# EAGLE schematic wheel_board_front (EAGLE 9.5.0)
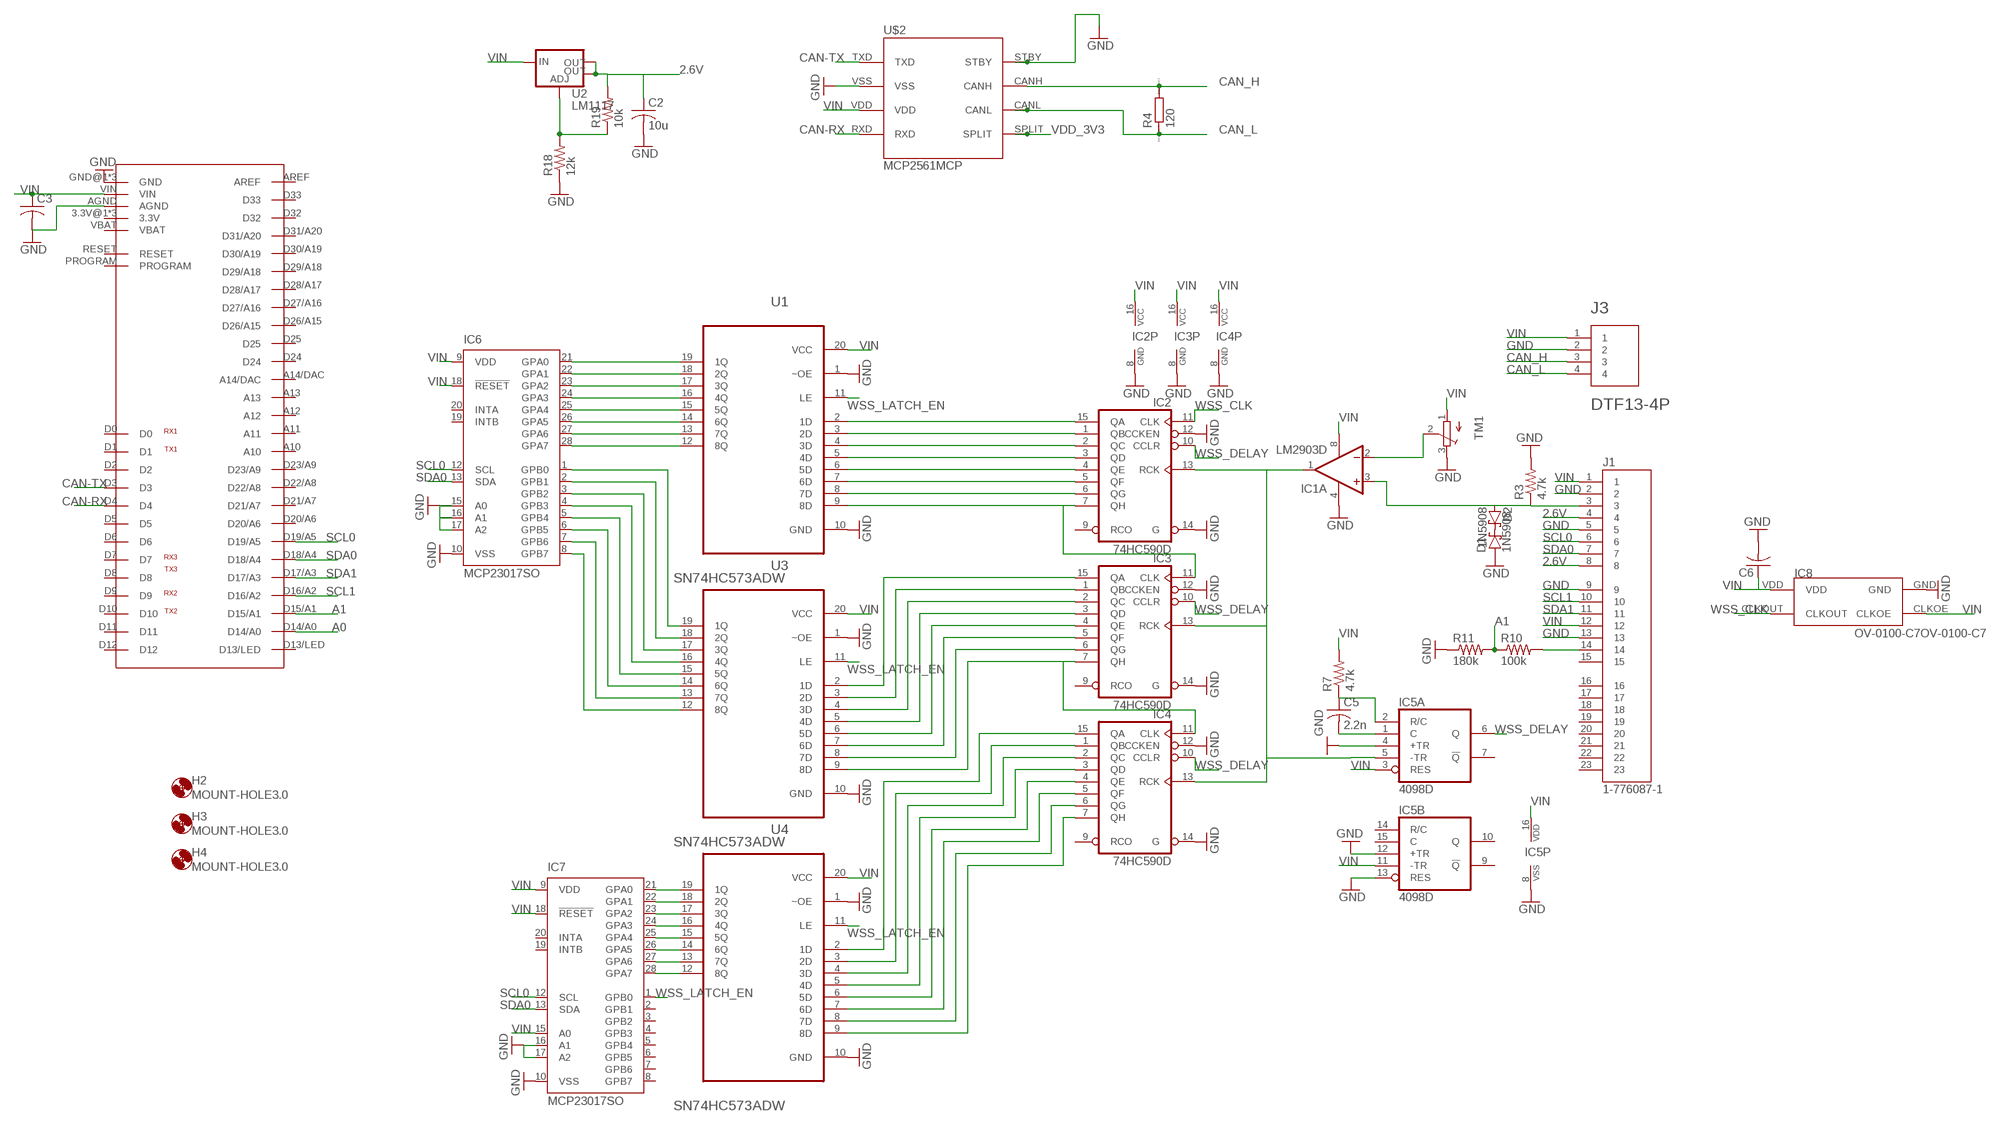
[diagram p0: schematic, sheet 1]

## Parts
C2  10u  C-US050-024X044  [C050-024X044]
C3  C-US050-024X044  [C050-024X044]
C5  2.2n  C-US025-024X044  [C025-024X044]
C6  C-US050-024X044  [C050-024X044]
D1  1N5908  [C4111-15]
D2  1N5908  [C4111-15]
H2  MOUNT-HOLE3.0  [3,0]
H3  MOUNT-HOLE3.0  [3,0]
H4  MOUNT-HOLE3.0  [3,0]
IC1  LM2903D  [SO08]
IC2  74HC590D  [SO16]
IC3  74HC590D  [SO16]
IC4  74HC590D  [SO16]
IC5  4098D  [SO16]
IC6  MCP23017SO  [SO28W]
IC7  MCP23017SO  [SO28W]
IC8  OV-0100-C7OV-0100-C7  [DFN320X150X100-4N]
J1  1-776087-1  [TE_1-776087-1]
J3  DTF13-4P  [TE_DTF13-4P]
R3  4.7k  R-US_0204/7  [0204/7]
R4  120  R  [R0805]
R7  4.7k  R-US_0204/7  [0204/7]
R10  100k  R-US_0204/7  [0204/7]
R11  180k  R-US_0204/7  [0204/7]
R18  12k  R-US_0204/7  [0204/7]
R19  10k  R-US_0204/7  [0204/7]
TM1  TRIMPOTTC33X  [TC33X]
U1  SN74HC573ADW  [SOIC127P1030X265-20N]
U2  LM1117  V_REG_LM1117SOT223  [SOT223]
U3  SN74HC573ADW  [SOIC127P1030X265-20N]
U4  SN74HC573ADW  [SOIC127P1030X265-20N]
U$2  MCP2561MCP  [MCP2561_PDIP]
U$3  TEENSY3.1_ALL  [TEENSY3.1_ALL]

## Nets
2.6V [pwr]: C2.1 J1.4 J1.8 R19.2 U2.2(OUT) U2.4(OUT)
A0: U$3.D14/A0
A1: R10.1 R11.2 U$3.D15/A1
CAN-RX: U$2.RXD U$3.D4
CAN-TX: U$2.TXD U$3.D3
CAN_H: J3.3 R4.2 U$2.CANH
CAN_L: J3.4 R4.1 U$2.CANL
GND [pwr]: C2.2 C3.2 C6.2 D1.A IC1.4(P:V-) IC2.8(GND) IC2.12(CCKEN) IC2.14(G) IC3.8(GND) IC3.12(CCKEN) IC3.14(G) IC4.8(GND) IC4.12(CCKEN) IC4.14(G) IC5.4(A:+TR) IC5.8(P:VSS) IC5.12(B:+TR) IC5.13(B:RES) IC6.10(VSS) IC6.15(A0) IC6.16(A1) IC6.17(A2) IC7.10(VSS) IC7.16(A1) IC7.17(A2) IC8.GND J1.2 J1.5 J1.9 J1.13 J3.2 R3.2 R11.1 R18.1 TM1.3(E) U1.1(~OE) U1.10(GND) U3.1(~OE) U3.10(GND) U4.1(~OE) U4.10(GND) U$2.STBY U$2.VSS U$3.AGND U$3.GND@1(GND) U$3.GND@2(GND) U$3.GND@3(GND)
N$1 [pwr]: D2.A IC1.3(A:+IN) J1.3 R3.1
N$2: J1.14 R10.2
N$3: IC1.2(A:-IN) TM1.2(S)
N$4: C5.1 IC5.2(A:R/C) R7.1
N$5: IC2.15(QA) U1.2(1D)
N$8: C5.2 IC5.1(A:C)
N$9: IC1.1(A:OUT) IC2.13(RCK) IC3.13(RCK) IC4.13(RCK) IC5.5(A:-TR)
N$10: IC2.7(QH) IC3.11(CLK) U1.9(8D)
N$11: IC3.7(QH) IC4.11(CLK) U3.9(8D)
N$12: IC2.1(QB) U1.3(2D)
N$13 [pwr]: D1.C D2.C
N$14 [pwr]: R18.2 R19.1 U2.1(ADJ)
N$15: IC2.2(QC) U1.4(3D)
N$16: IC2.3(QD) U1.5(4D)
N$17: IC2.4(QE) U1.6(5D)
N$18: IC2.5(QF) U1.7(6D)
N$19: IC2.6(QG) U1.8(7D)
N$20: IC3.15(QA) U3.2(1D)
N$21: IC3.1(QB) U3.3(2D)
N$22: IC3.2(QC) U3.4(3D)
N$23: IC3.3(QD) U3.5(4D)
N$24: IC3.4(QE) U3.6(5D)
N$25: IC3.5(QF) U3.7(6D)
N$26: IC3.6(QG) U3.8(7D)
N$27: IC4.15(QA) U4.2(1D)
N$28: IC4.1(QB) U4.3(2D)
N$29: IC4.2(QC) U4.4(3D)
N$30: IC4.3(QD) U4.5(4D)
N$31: IC4.4(QE) U4.6(5D)
N$32: IC4.5(QF) U4.7(6D)
N$33: IC4.6(QG) U4.8(7D)
N$34: IC4.7(QH) U4.9(8D)
N$35: IC6.21(GPA0) U1.19(1Q)
N$36: IC6.22(GPA1) U1.18(2Q)
N$37: IC6.23(GPA2) U1.17(3Q)
N$38: IC6.24(GPA3) U1.16(4Q)
N$39: IC6.25(GPA4) U1.15(5Q)
N$40: IC6.26(GPA5) U1.14(6Q)
N$41: IC6.27(GPA6) U1.13(7Q)
N$42: IC6.28(GPA7) U1.12(8Q)
N$43: IC6.1(GPB0) U3.19(1Q)
N$44: IC6.2(GPB1) U3.18(2Q)
N$45: IC6.3(GPB2) U3.17(3Q)
N$46: IC6.4(GPB3) U3.16(4Q)
N$47: IC6.5(GPB4) U3.15(5Q)
N$48: IC6.6(GPB5) U3.14(6Q)
N$49: IC6.7(GPB6) U3.13(7Q)
N$50: IC6.8(GPB7) U3.12(8Q)
N$51: IC7.21(GPA0) U4.19(1Q)
N$52: IC7.22(GPA1) U4.18(2Q)
N$53: IC7.23(GPA2) U4.17(3Q)
N$54: IC7.24(GPA3) U4.16(4Q)
N$55: IC7.25(GPA4) U4.15(5Q)
N$56: IC7.26(GPA5) U4.14(6Q)
N$57: IC7.27(GPA6) U4.13(7Q)
N$58: IC7.28(GPA7) U4.12(8Q)
SCL0: IC6.12(SCL) IC7.12(SCL) J1.6 U$3.D19/A5
SCL1: J1.10 U$3.D16/A2
SDA0: IC6.13(SDA) IC7.13(SDA) J1.7 U$3.D18/A4
SDA1: J1.11 U$3.D17/A3
VDD_3V3: U$2.SPLIT
VIN [pwr]: C3.1 C6.1 IC1.8(P:V+) IC2.16(VCC) IC3.16(VCC) IC4.16(VCC) IC5.3(A:RES) IC5.11(B:-TR) IC5.16(P:VDD) IC6.9(VDD) IC6.18(!RESET) IC7.9(VDD) IC7.15(A0) IC7.18(!RESET) IC8.CLKOE IC8.VDD J1.1 J1.12 J3.1 R7.2 TM1.1(A) U1.20(VCC) U2.3(IN) U3.20(VCC) U4.20(VCC) U$2.VDD U$3.VIN
WSS_CLK: IC2.11(CLK) IC8.CLKOUT
WSS_DELAY: IC2.10(CCLR) IC3.10(CCLR) IC4.10(CCLR) IC5.6(A:Q)
WSS_LATCH_EN: IC7.1(GPB0) U1.11(LE) U3.11(LE) U4.11(LE)
Unconnected: IC1.5(B:+IN) IC1.6(B:-IN) IC1.7(B:OUT) IC2.9(RCO) IC3.9(RCO) IC4.9(RCO) IC5.7(A:!Q) IC5.9(B:!Q) IC5.10(B:Q) IC5.14(B:R/C) IC5.15(B:C) IC6.19(INTB) IC6.20(INTA) IC7.2(GPB1) IC7.3(GPB2) IC7.4(GPB3) IC7.5(GPB4) IC7.6(GPB5) IC7.7(GPB6) IC7.8(GPB7) IC7.19(INTB) IC7.20(INTA) J1.15 J1.16 J1.17 J1.18 J1.19 J1.20 J1.21 J1.22 J1.23 U$3.3.3V@1(3.3V) U$3.3.3V@2(3.3V) U$3.3.3V@3(3.3V) U$3.A10 U$3.A11 U$3.A12 U$3.A13 U$3.A14/DAC U$3.AREF U$3.D0 U$3.D1 U$3.D2 U$3.D5 U$3.D6 U$3.D7 U$3.D8 U$3.D9 U$3.D10 U$3.D11 U$3.D12 U$3.D13/LED U$3.D20/A6 U$3.D21/A7 U$3.D22/A8 U$3.D23/A9 U$3.D24 U$3.D25 U$3.D26/A15 U$3.D27/A16 U$3.D28/A17 U$3.D29/A18 U$3.D30/A19 U$3.D31/A20 U$3.D32 U$3.D33 U$3.PROGRAM U$3.RESET U$3.VBAT

## Library data of the parts
C2 C3 C5 C6 = rcl:C-US: CAPACITOR, American symbol; SPICEPREFIX: C
D1 D2 = diode:1N5908: DIODE schottky
H2-H4 = holes:MOUNT-HOLE: MOUNTING HOLE with drill center marker
IC1 = linear:LM2903: COMPARATOR
IC2-IC4 = 74xx-eu:74*590: 8-bit binary COUNTER, output register
IC5 = 40xx:4098: Dual monostable MULTIVIBRATOR Source: Texas Instruments (Data sheet acquired frm Harris Semiconductor SCHS065) http://pdf1.alldatasheet.com/datasheet-pdf/view/26897/TI/CD4098.html
IC6 IC7 = adafruit:MCP23017: http://ww1.microchip.com/downloads/en/DeviceDoc/21952a.pdf Source: http://ww1.microchip.com/downloads/en/DeviceDoc/21952a.pdf
IC8 = OV-0100-C7:OV-0100-C7
J1 = 1-776087-1:1-776087-1: 23 Positions Header Connector 0.157" (4.00mm) Panel Mount, Through Hole, Right Angle Gold-Palladium, Black; AVAILABILITY: Unavailable; COMMENT: 1-776087-1; DESCRIPTION: AMPSEAL Series; 4mm Pitch 23 Way 3 Row Right Angle PCB Header; Solder Term; 8A; EU_ROHS_COMPLIANCE: Compliant; MF: TE Connectivity; MP: 1-776087-1; PACKAGE: None; PRICE: None; TE_PURCHASE_URL: https://www.te.com/usa-en/product-1-776087-1.html?te_bu=Cor&te_type=disp&te_campaign=seda_glo_cor-seda-global-disp-prtnr-fy19-seda-model-bom-cta_sma-317_1&elqCampaignId=32493
J3 = DTF13-4P:DTF13-4P: none; AVAILABILITY: In stock; MF: TE Connectivity; MPN: DTF13-4P; PARTREV: NC; STANDARD: Manufacturer recommendation
R3 R7 R10 R11 R18 R19 = rcl:R-US_: RESISTOR, American symbol; SPICEPREFIX: R
R4 = eagle-ltspice:R: RESISTOR, European symbol; SPICEMODEL: NONE; SPICEPREFIX: R
TM1 = adafruit:TRIMPOT: SMT trimmer potentiometer part number TC33X http://www.ladyada.net/library/eagle
U1 U3 U4 = SN74HC573ADW:SN74HC573ADW: Octal transparent D-type latches with 3-state outputs; AVAILABILITY: Unavailable; DESCRIPTION: Octal Transparent D-Type Latches With 3-State Outputs 20-SOIC -40 to 85; MF: Texas Instruments; MP: SN74HC573ADW; PACKAGE: SOIC-20 Texas Instruments; PRICE: None
U2 = SparkFun-IC-Power:V_REG_LM1117: Voltage Regulator LM1117 Standard adjustable voltage regulator but in SMD form. Spark Fun Electronics SKU : COM-00595; PROD_ID: VREG-08170
U$2 = PoJD:MCP2561: High-Speed CAN Transceiver See http://ww1.microchip.com/downloads/en/DeviceDoc/25167A.pdf The MCP2561/2 is a Microchip Technology Inc. second generation high-speed CAN transceiver. It serves as an interface between a CAN protocol controller and the physical two-wire CAN bus. The device meets the automotive requirements for high-speed (up to 1 Mb/s), low quiescent current, electromagnetic compatibility (EMC) and electrostatic discharge (ESD).
U$3 = Teensy3.1:TEENSY3.1_ALL

## Net classes
0 default: width 0.508 mm, drill 0.55 mm
1 pwr: width 0.635 mm, clearance 0.381 mm